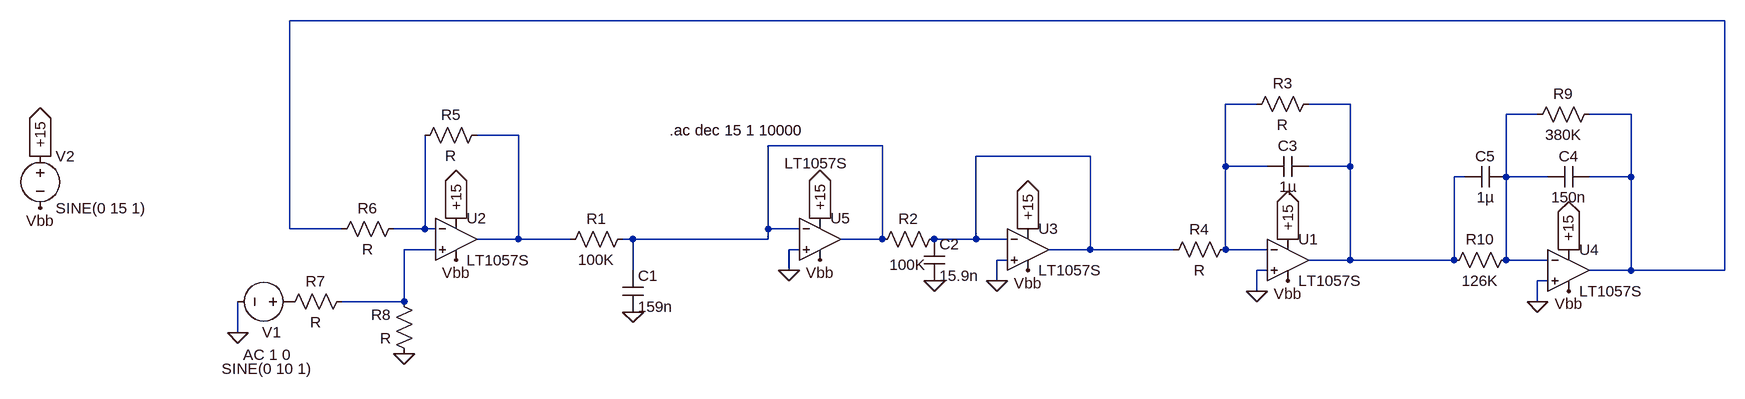
[diagram p0: schematic Draft2.asc]
Draft2.asc, the LTspice schematic file:
Version 4
SHEET 1 2404 680
WIRE 1776 -208 -432 -208
WIRE 1056 -80 1008 -80
WIRE 1200 -80 1136 -80
WIRE 1488 -64 1440 -64
WIRE 1632 -64 1568 -64
WIRE -80 -32 -144 -32
WIRE 480 -16 304 -16
WIRE 800 0 624 0
WIRE 1008 16 1008 -80
WIRE 1072 16 1008 16
WIRE 1200 16 1200 -80
WIRE 1200 16 1136 16
WIRE 1376 32 1360 32
WIRE 1440 32 1440 -64
WIRE 1504 32 1440 32
WIRE 1632 32 1632 -64
WIRE 1632 32 1568 32
WIRE -432 112 -432 -208
WIRE -352 112 -432 112
WIRE -224 112 -224 -32
WIRE -224 112 -272 112
WIRE -208 112 -224 112
WIRE 304 112 304 -16
WIRE 352 112 304 112
WIRE -80 128 -80 -32
WIRE -80 128 -144 128
WIRE 0 128 -80 128
WIRE 96 128 80 128
WIRE 304 128 304 112
WIRE 304 128 96 128
WIRE 480 128 480 -16
WIRE 480 128 416 128
WIRE 624 128 624 0
WIRE 624 128 560 128
WIRE 672 128 624 128
WIRE -208 144 -256 144
WIRE 352 144 336 144
WIRE 800 144 800 0
WIRE 800 144 736 144
WIRE 928 144 800 144
WIRE 1008 144 1008 16
WIRE 1072 144 1008 144
WIRE 672 160 656 160
WIRE 1200 160 1200 16
WIRE 1200 160 1136 160
WIRE 1360 160 1360 32
WIRE 1360 160 1200 160
WIRE 1440 160 1440 32
WIRE 1504 160 1440 160
WIRE 96 176 96 128
WIRE 336 176 336 144
WIRE 1072 176 1056 176
WIRE 1632 176 1632 32
WIRE 1632 176 1568 176
WIRE 1776 176 1776 -208
WIRE 1776 176 1632 176
WIRE 656 192 656 160
WIRE 1504 192 1488 192
WIRE 1056 208 1056 176
WIRE -256 224 -256 144
WIRE -256 224 -352 224
WIRE 1488 224 1488 192
WIRE -512 272 -512 224
FLAG 96 240 0
FLAG 560 192 0
FLAG -512 272 0
FLAG -816 80 Vbb
FLAG -816 0 +15
IOPIN -816 0 Out
FLAG 704 176 Vbb
FLAG 704 112 +15
IOPIN 704 112 Out
FLAG 656 192 0
FLAG 1104 192 Vbb
FLAG 1104 128 +15
IOPIN 1104 128 Out
FLAG 1056 208 0
FLAG -176 160 Vbb
FLAG -176 96 +15
IOPIN -176 96 Out
FLAG -256 304 0
FLAG 1536 208 Vbb
FLAG 1536 144 +15
IOPIN 1536 144 Out
FLAG 1488 224 0
FLAG 384 160 Vbb
FLAG 384 96 +15
IOPIN 384 96 Out
FLAG 336 176 0
SYMBOL voltage -816 -16 R0
WINDOW 123 0 0 Left 0
WINDOW 39 0 0 Left 0
SYMATTR InstName V2
SYMATTR Value SINE(0 15 1)
SYMBOL res 576 112 R90
WINDOW 0 0 56 VBottom 2
WINDOW 3 40 57 VTop 2
SYMATTR InstName R2
SYMATTR Value 100K
SYMBOL voltage -416 224 R90
WINDOW 0 47 29 VRight 2
WINDOW 3 103 -19 VRight 2
WINDOW 123 82 14 VRight 2
WINDOW 39 0 0 Left 0
SYMATTR InstName V1
SYMATTR Value SINE(0 10 1)
SYMATTR Value2 AC 1 0
SYMBOL res 96 112 R90
WINDOW 0 0 56 VBottom 2
WINDOW 3 32 56 VTop 2
SYMATTR InstName R1
SYMATTR Value 100K
SYMBOL cap 80 176 R0
SYMATTR InstName C1
SYMATTR Value 159n
SYMBOL cap 544 128 R0
SYMATTR InstName C2
SYMATTR Value 15.9n
SYMBOL OpAmps\\LT1057S 704 80 R0
SYMATTR InstName U3
SYMBOL OpAmps\\LT1057S 1104 96 R0
SYMATTR InstName U1
SYMBOL cap 1136 0 R90
WINDOW 0 0 32 VBottom 2
WINDOW 3 32 32 VTop 2
SYMATTR InstName C3
SYMATTR Value 1µ
SYMBOL res 1152 -96 R90
WINDOW 0 0 56 VBottom 2
WINDOW 3 32 56 VTop 2
SYMATTR InstName R3
SYMBOL res 1024 128 R90
WINDOW 0 0 56 VBottom 2
WINDOW 3 32 56 VTop 2
SYMATTR InstName R4
SYMBOL OpAmps\\LT1057S -176 64 R0
SYMATTR InstName U2
SYMBOL res -128 -48 R90
WINDOW 0 0 56 VBottom 2
WINDOW 3 32 56 VTop 2
SYMATTR InstName R5
SYMBOL res -256 96 R90
WINDOW 0 0 56 VBottom 2
WINDOW 3 32 56 VTop 2
SYMATTR InstName R6
SYMBOL res -240 320 R180
WINDOW 0 36 76 Left 2
WINDOW 3 36 40 Left 2
SYMATTR InstName R8
SYMBOL res -336 208 R90
WINDOW 0 0 56 VBottom 2
WINDOW 3 32 56 VTop 2
SYMATTR InstName R7
SYMBOL OpAmps\\LT1057S 1536 112 R0
SYMATTR InstName U4
SYMBOL cap 1568 16 R90
WINDOW 0 0 32 VBottom 2
WINDOW 3 32 32 VTop 2
SYMATTR InstName C4
SYMATTR Value 150n
SYMBOL res 1584 -80 R90
WINDOW 0 0 56 VBottom 2
WINDOW 3 32 56 VTop 2
SYMATTR InstName R9
SYMATTR Value 380K
SYMBOL res 1456 144 R90
WINDOW 0 0 56 VBottom 2
WINDOW 3 32 56 VTop 2
SYMATTR InstName R10
SYMATTR Value 126K
SYMBOL cap 1440 16 R90
WINDOW 0 0 32 VBottom 2
WINDOW 3 32 32 VTop 2
SYMATTR InstName C5
SYMATTR Value 1µ
SYMBOL OpAmps\\LT1057S 384 64 R0
WINDOW 3 -55 -53 Left 2
SYMATTR InstName U5
TEXT 152 -40 Left 2 !.ac dec 15 1 10000

The netlist it stands for:
* Draft2.asc
V2 +15 Vbb SINE(0 15 1)
R2 N007 N006 100K
V1 P001 0 SINE(0 10 1) AC 1 0
R1 N006 N005 100K
C1 N006 0 159n
C2 N007 0 15.9n
XU3 0 N007 +15 Vbb N007 LT1057S  ; pins In+ In- V+ V- OUT
XU1 0 N002 +15 Vbb N003 LT1057S  ; pins In+ In- V+ V- OUT
C3 N003 N002 1µ
R3 N003 N002 R
R4 N002 N007 R
XU2 N009 N008 +15 Vbb N005 LT1057S  ; pins In+ In- V+ V- OUT
R5 N005 N008 R
R6 N008 N001 R
R8 0 N009 R
R7 N009 P001 R
XU4 0 N004 +15 Vbb N001 LT1057S  ; pins In+ In- V+ V- OUT
C4 N001 N004 150n
R9 N001 N004 380K
R10 N004 N003 126K
C5 N004 N003 1µ
XU5 0 N006 +15 Vbb N006 LT1057S  ; pins In+ In- V+ V- OUT
.ac dec 15 1 10000
.backanno
.end